# Altium schematic sheet LVDSDriverReceiver.SchDoc
size B
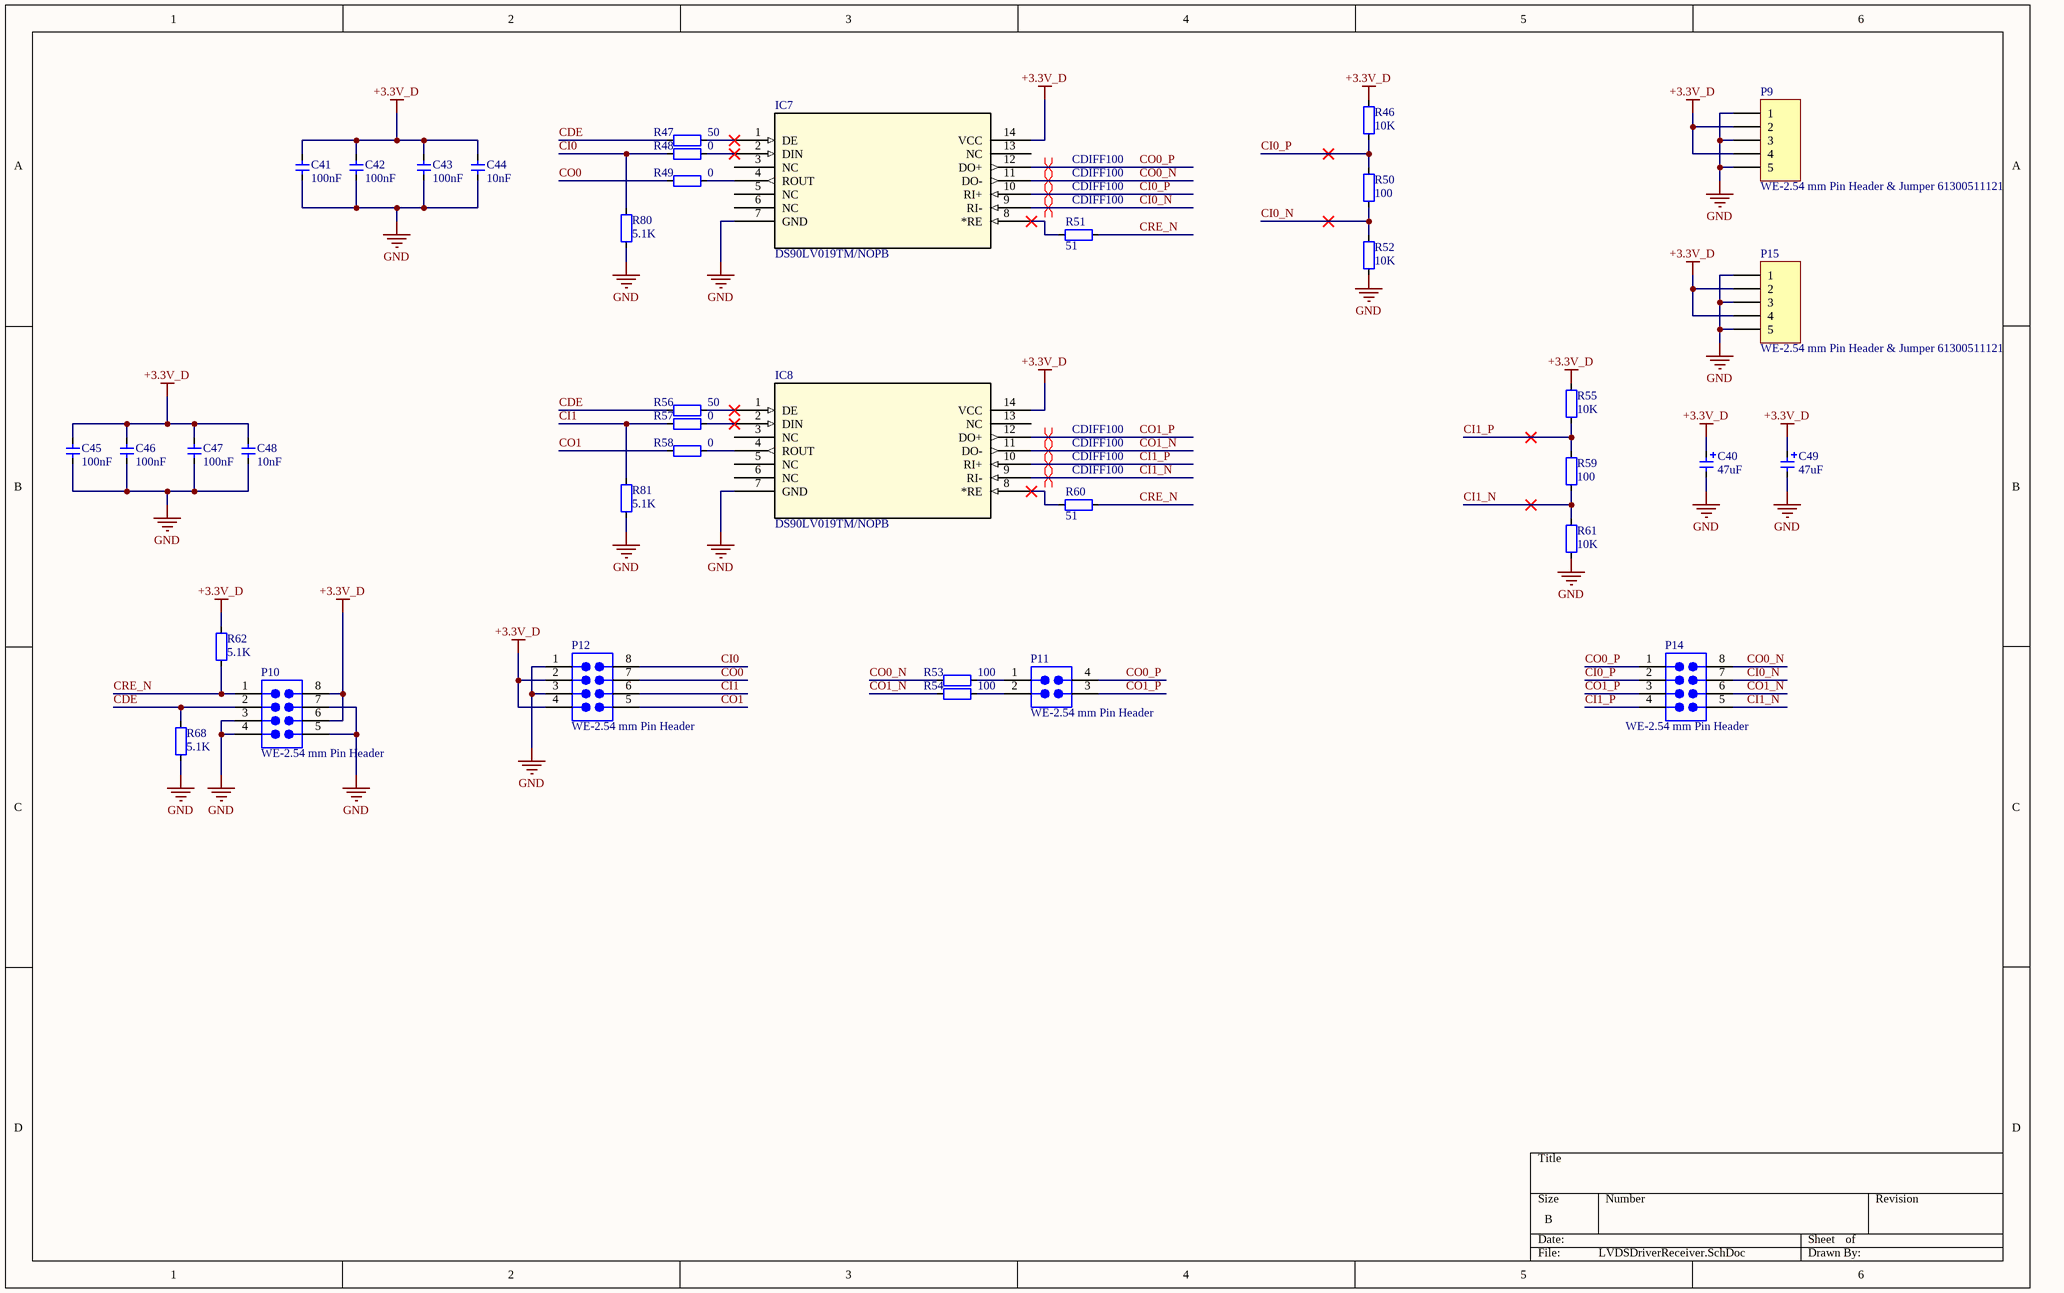
[diagram p0: LVDSDriverReceiver.SchDoc]

## Parts
C40  value 47uF  [CAP_TAN_B1210]  (hidden comment: Cap_Tan_1210)
C41  value 100nF  [CAP_0603]  (hidden comment: Cap_0603)
C42  value 100nF  [CAP_0603]  (hidden comment: Cap_0603)
C43  value 100nF  [CAP_0603]  (hidden comment: Cap_0603)
C44  value 10nF  [CAP_0603]  (hidden comment: Cap_0603)
C45  value 100nF  [CAP_0603]  (hidden comment: Cap_0603)
C46  value 100nF  [CAP_0603]  (hidden comment: Cap_0603)
C47  value 100nF  [CAP_0603]  (hidden comment: Cap_0603)
C48  value 10nF  [CAP_0603]  (hidden comment: Cap_0603)
C49  value 47uF  [CAP_TAN_B1210]  (hidden comment: Cap_Tan_1210)
IC7  DS90LV019TM/NOPB  [M14A]
IC8  DS90LV019TM/NOPB  [M14A]
P9  WE-2.54 mm Pin Header & Jumper 61300511121  [61300511121]
P10  WE-2.54 mm Pin Header  [610x0821121]
P11  WE-2.54 mm Pin Header  [610x0421121]
P12  WE-2.54 mm Pin Header  [610x0821121]
P14  WE-2.54 mm Pin Header  [610x0821121]
P15  WE-2.54 mm Pin Header & Jumper 61300511121  [61300511121]
R46  value 10K  [RES_0603]  (hidden comment: Res_0603)
R47  value 50  [RES_0603]  (hidden comment: Res_0603)
R48  value 0  [RES_0603]  (hidden comment: Res_0603)
R49  value 0  [RES_0603]  (hidden comment: Res_0603)
R50  value 100  [RES_0603]  (hidden comment: Res_0603)
R51  value 51  [RES_0603]  (hidden comment: Res_0603)
R52  value 10K  [RES_0603]  (hidden comment: Res_0603)
R53  value 100  [RES_0603]  (hidden comment: Res_0603)
R54  value 100  [RES_0603]  (hidden comment: Res_0603)
R55  value 10K  [RES_0603]  (hidden comment: Res_0603)
R56  value 50  [RES_0603]  (hidden comment: Res_0603)
R57  value 0  [RES_0603]  (hidden comment: Res_0603)
R58  value 0  [RES_0603]  (hidden comment: Res_0603)
R59  value 100  [RES_0603]  (hidden comment: Res_0603)
R60  value 51  [RES_0603]  (hidden comment: Res_0603)
R61  value 10K  [RES_0603]  (hidden comment: Res_0603)
R62  value 5.1K  [RES_0603]  (hidden comment: Res_0603)
R68  value 5.1K  [RES_0603]  (hidden comment: Res_0603)
R80  value 5.1K  [RES_0603]  (hidden comment: Res_0603)
R81  value 5.1K  [RES_0603]  (hidden comment: Res_0603)

## Nets
+3.3V_D: C40.1 C41.2 C42.2 C43.2 C44.2 C45.2 C46.2 C47.2 C48.2 C49.1 IC7.14(VCC) IC8.14(VCC) P9.2 P9.4 P10.6 P10.8 P12.2 P12.4 P15.2 P15.4 R46.2 R55.2 R62.1
GND: C40.2 C41.1 C42.1 C43.1 C44.1 C45.1 C46.1 C47.1 C48.1 C49.2 IC7.7(GND) IC8.7(GND) P9.1 P9.3 P9.5 P10.3 P10.4 P10.5 P10.7 P12.1 P12.3 P15.1 P15.3 P15.5 R52.1 R61.1 R68.2 R80.2 R81.2
CDE: P10.2 R47.2 R56.2 R68.1
CI0: P12.8 R48.2 R80.1
CI0_N: IC7.9(RI-) P14.7 R50.1 R52.2
CI0_P: IC7.10(RI+) P14.2 R46.1 R50.2
CI1: P12.6 R57.2 R81.1
CI1_N: IC8.9(RI-) P14.5 R59.1 R61.2
CI1_P: IC8.10(RI+) P14.4 R55.1 R59.2
CO0: P12.7 R49.2
CO0_N: IC7.11(DO-) P14.8 R53.2
CO0_P: IC7.12(DO+) P11.4 P14.1
CO1: P12.5 R58.2
CO1_N: IC8.11(DO-) P14.6 R54.2
CO1_P: IC8.12(DO+) P11.3 P14.3
CRE_N: P10.1 R51.1 R60.1 R62.2
NetIC7_1: IC7.1(DE) R47.1
NetIC7_2: IC7.2(DIN) R48.1
NetIC7_4: IC7.4(ROUT) R49.1
NetIC7_8: IC7.8(*RE) R51.2
NetIC8_1: IC8.1(DE) R56.1
NetIC8_2: IC8.2(DIN) R57.1
NetIC8_4: IC8.4(ROUT) R58.1
NetIC8_8: IC8.8(*RE) R60.2
NetP11_1: P11.1 R53.1
NetP11_2: P11.2 R54.1

Not connected (* = marked no-connect by the designer): IC7 3(NC) 5(NC) 6(NC) 13(NC); IC8 3(NC) 5(NC) 6(NC) 13(NC)

## Layout directives
differential pair; net class CDIFF100: CI0_N, CI0_P, CI1_N, CI1_P, CO0_N, CO0_P, CO1_N, CO1_P

## Library data of the parts
C40 C49 = Cap_Tan_1210: Capacitor
C41-C48 = Cap_0603: Capacitor
IC7 IC8 = DS90LV019TM/NOPB: Imported; Manufacturer_Part_Number: ds90lv019tmnopb; Vendor: National Semiconductor; C: Copyright (C) 2015 Accelerated Designs. All rights reserved; Copyright: Copyright (C) 2015 Accelerated Designs. All rights reserved; RefDes: RefDes; Type: DEV; Value: Value
P9 P15 = WE-2.54 mm Pin Header & Jumper 61300511121: WR-PHD 2.54mm Pin Header; Manufacturer: WЁ№rth Elektronik eiSos GmbH; ComponentLink1 Description: Manufacturer; ComponentLink2 Description: Datasheet; NoPins: 05; Created Date: 22 March 2013; partNo: 61300511121; ComponentLink1URL: http://www.we-online.com; ComponentLink2URL: http://katalog.we-online.de/em/datasheet/6130xx11121.pdf; Created by: Karrer Zheng
P10 P12 P14 = WE-2.54 mm Pin Header & Jumper 610x0821121: WR-PHD 2.54 mm Dual SMT Pin Header; Manufacturer: WЁ№rth Elektronik eiSos GmbH; ComponentLink1 Description: Manufacturer; ComponentLink2 Description: Datasheet; NoPins: 08; Created Date: 22 March 2013; partNo: 610x0821121; ComponentLink1URL: http://www.we-online.com; ComponentLink2URL: http://katalog.we-online.de/em/datasheet/6100xx21121.pdf; Created by: Karrer Zheng
P11 = WE-2.54 mm Pin Header & Jumper 610x0421121: WR-PHD 2.54 mm Dual SMT Pin Header; Manufacturer: WЁ№rth Elektronik eiSos GmbH; ComponentLink1 Description: Manufacturer; ComponentLink2 Description: Datasheet; NoPins: 04; Created Date: 22 March 2013; partNo: 610x0421121; ComponentLink1URL: http://www.we-online.com; ComponentLink2URL: http://katalog.we-online.de/em/datasheet/6100xx21121.pdf; Created by: Karrer Zheng
R46-R62 R68 R80 R81 = Res_0603: Resistor